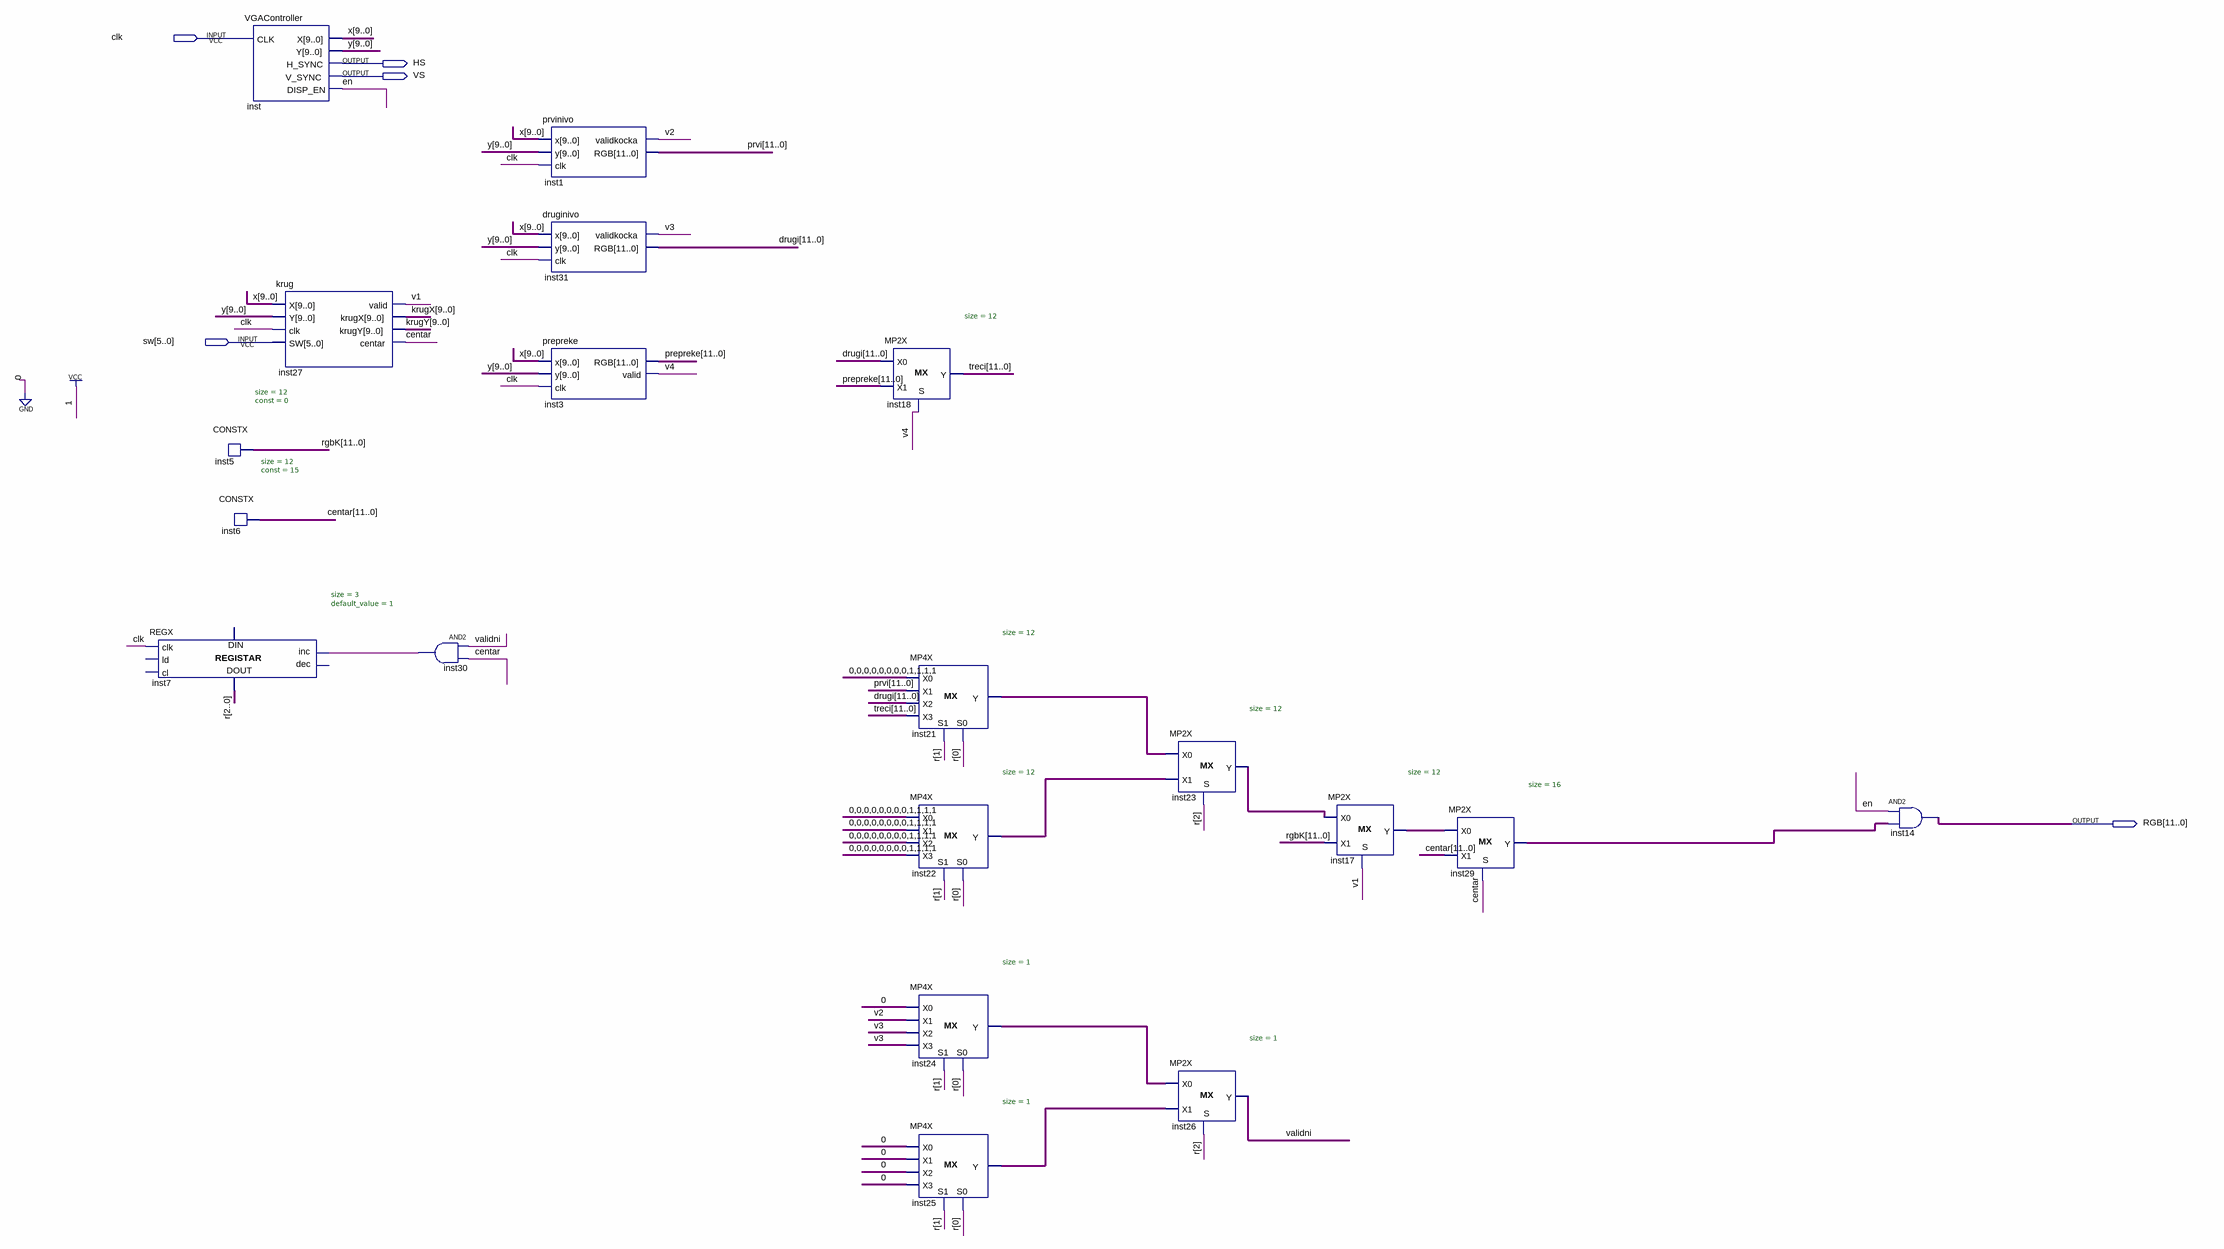
[diagram p0: schematic sheet]
// Quartus schematic sema.bdf as structural Verilog: 19 symbols, 5 pins
module sema (
  input  clk,
  input  [5:0] sw,
  output HS,
  output VS,
  output [11:0] RGB
);

  wire centar_1bit, en, inst24_y, inst25_y, inst30_out, v1, v2, v3, v4, validni;
  wire [2:0] r;
  wire [9:0] krugX, krugY, x, y;
  wire [11:0] centar, drugi, inst21_y, inst22_y, inst23_y, prepreke, prvi, rgbK, treci;
  wire [15:0] inst17_y, inst29_y;

  REGX #(.size(3), .default_value(1)) inst7 (.clk(clk), .inc(inst30_out), .data_out(r));  // open: ld, cl, dec, data_in
  CONSTX #(.size(12), .\const (0)) inst5 (.data(rgbK));
  CONSTX #(.size(12), .\const (15)) inst6 (.data(centar));
  VGAController inst (.CLK(clk), .X(x), .Y(y), .H_SYNC(HS), .V_SYNC(VS), .DISP_EN(en));
  krug inst27 (.X(x), .Y(y), .clk(clk), .SW(sw), .valid(v1), .krugX(krugX), .krugY(krugY), .centar(centar_1bit));
  and inst30 (inst30_out, validni, centar_1bit);
  prvinivo inst1 (.x(x), .y(y), .clk(clk), .validkocka(v2), .RGB(prvi));
  druginivo inst31 (.x(x), .y(y), .clk(clk), .validkocka(v3), .RGB(drugi));
  prepreke inst3 (.x(x), .y(y), .clk(clk), .RGB(prepreke), .valid(v4));
  MP2X #(.size(12)) inst18 (.S(v4), .X0(drugi), .X1(prepreke), .Y(treci));
  MP4X #(.size(12)) inst21 (
    .S0(r[0]), .S1(r[1]), .X0(12'b000000001111), .X1(prvi), .X2(drugi), .X3(treci), .Y(inst21_y));
  MP4X #(.size(12)) inst22 (
    .S0(r[0]), .S1(r[1]), .X0(12'b000000001111), .X1(12'b000000001111), .X2(12'b000000001111),
    .X3(12'b000000001111), .Y(inst22_y));
  MP4X #(.size(1)) inst24 (.S0(r[0]), .S1(r[1]), .X0(1'b0), .X1(v2), .X2(v3), .X3(v3), .Y(inst24_y));
  MP4X #(.size(1)) inst25 (.S0(r[0]), .S1(r[1]), .X0(1'b0), .X1(1'b0), .X2(1'b0), .X3(1'b0), .Y(inst25_y));
  MP2X #(.size(12)) inst23 (.S(r[2]), .X0(inst21_y), .X1(inst22_y), .Y(inst23_y));
  MP2X #(.size(1)) inst26 (.S(r[2]), .X0(inst24_y), .X1(inst25_y), .Y(validni));
  MP2X #(.size(12)) inst17 (.S(v1), .X0(inst23_y), .X1(rgbK), .Y(inst17_y));
  MP2X #(.size(16)) inst29 (.S(centar_1bit), .X0(inst17_y), .X1(centar), .Y(inst29_y));
  assign RGB = {16{en}} & inst29_y;  // AND2 inst14, 16 bits wide
endmodule
